# EAGLE design D1MBLUE (EAGLE 6.5.0)
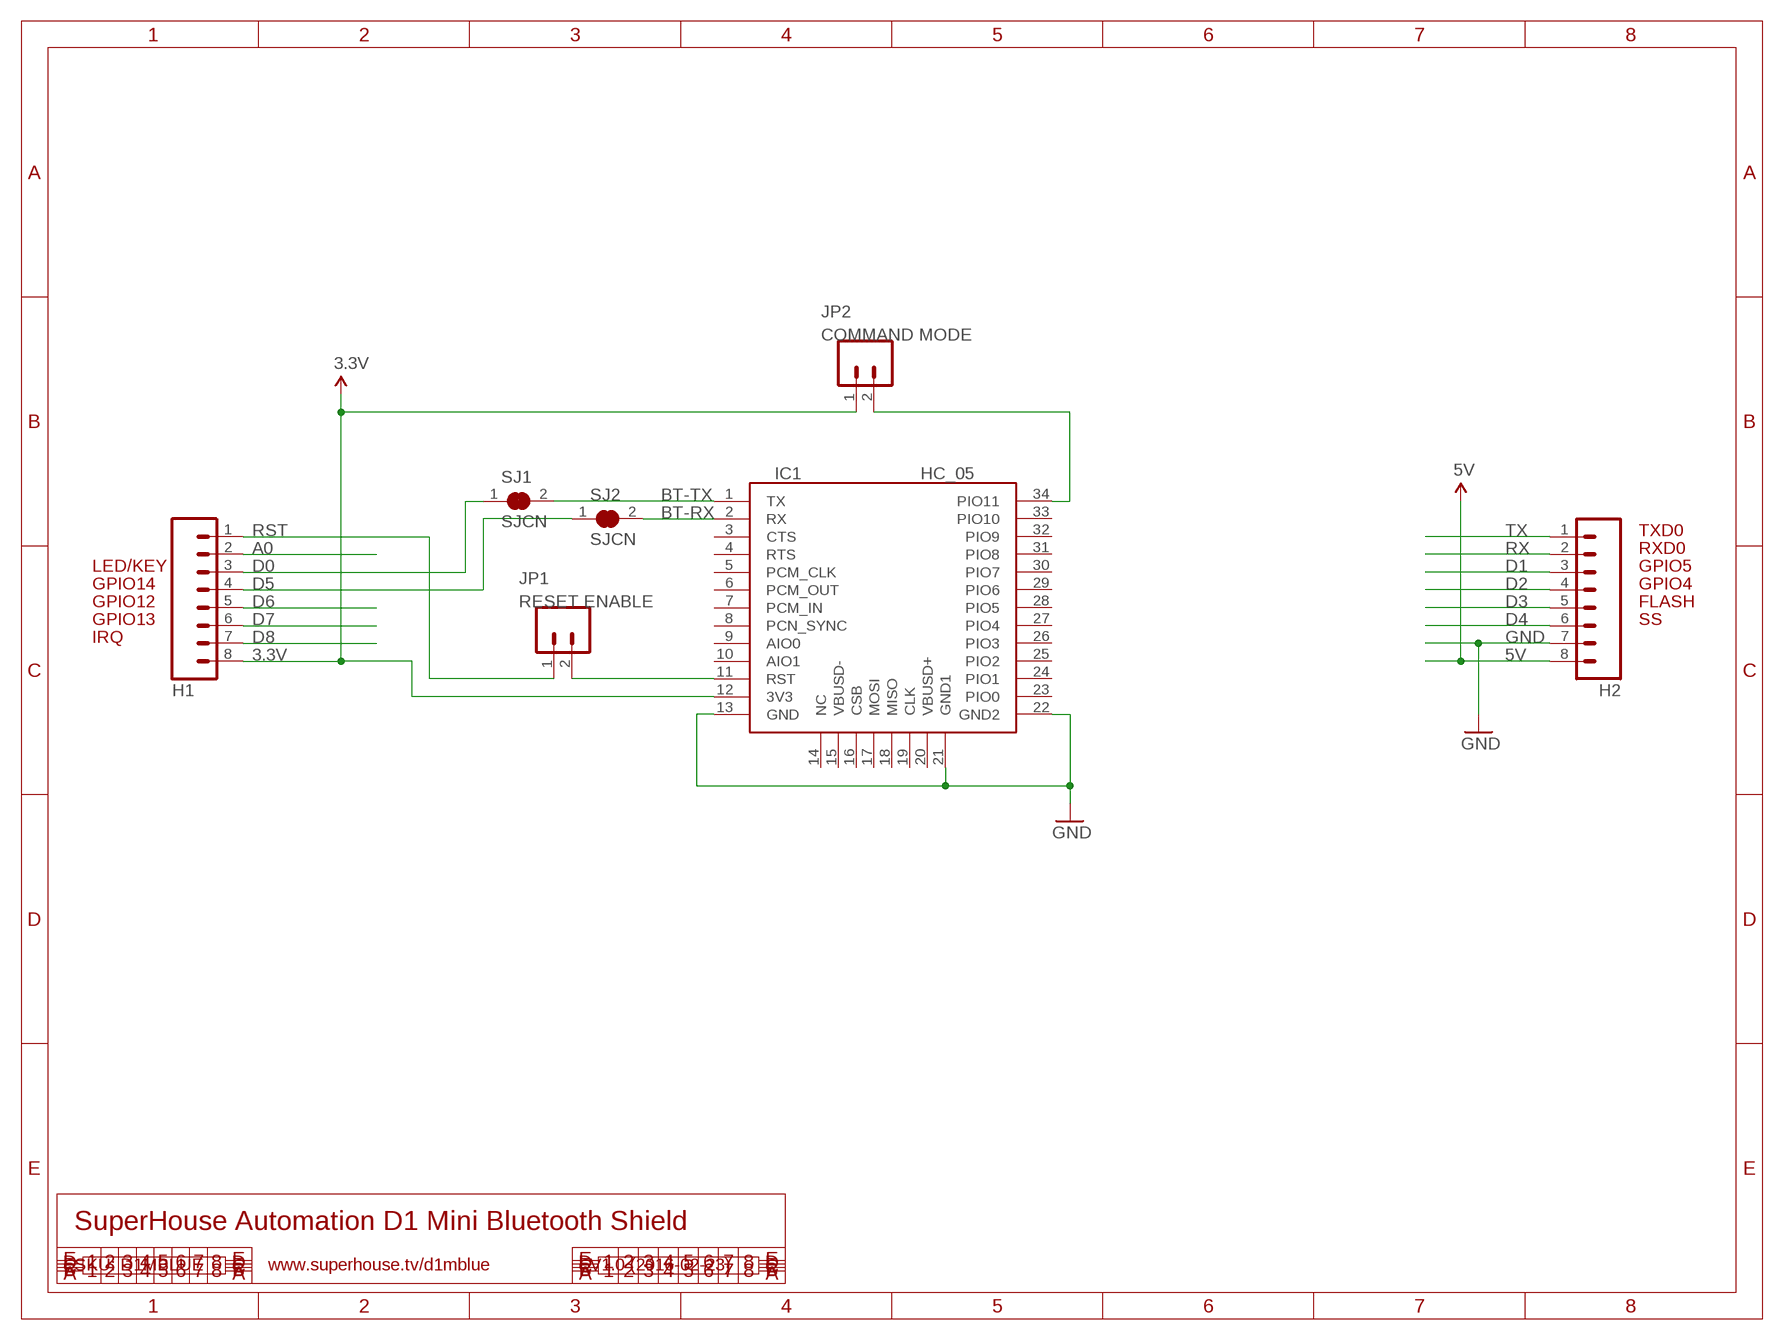
[diagram p0: schematic, sheet 1]

## Parts
H1  M08  [1X08]
H2  M08  [1X08]
IC1  HC_05  [BLUETOOTH_SMD]
JP1  RESET ENABLE  M02PTH  [1X02]
JP2  COMMAND MODE  M02PTH  [1X02]
SJ1  SJCN  [SJC]
SJ2  SJCN  [SJC]

## Nets
3.3V: H1.8 IC1.12(3V3) JP2.1
5V: H2.8
A0: H1.2
BT-RX: IC1.2(RX) SJ2.2
BT-TX: IC1.1(TX) SJ1.2
D0: H1.3 SJ1.1
D1: H2.3
D2: H2.4
D3: H2.5
D4: H2.6
D5: H1.4 SJ2.1
D6: H1.5
D7: H1.6
D8: H1.7
GND: H2.7 IC1.13(GND) IC1.21(GND1) IC1.22(GND2)
N$1: IC1.11(RST) JP1.2
N$3: IC1.34(PIO11) JP2.2
RST: H1.1 JP1.1
RX: H2.2
TX: H2.1
Unconnected: IC1.3(CTS) IC1.4(RTS) IC1.5(PCM_CLK) IC1.6(PCM_OUT) IC1.7(PCM_IN) IC1.8(PCN_SYNC) IC1.9(AIO0) IC1.10(AIO1) IC1.14(NC) IC1.15(VBUSD-) IC1.16(CSB) IC1.17(MOSI) IC1.18(MISO) IC1.19(CLK) IC1.20(VBUSD+) IC1.23(PIO0) IC1.24(PIO1) IC1.25(PIO2) IC1.26(PIO3) IC1.27(PIO4) IC1.28(PIO5) IC1.29(PIO6) IC1.30(PIO7) IC1.31(PIO8) IC1.32(PIO9) IC1.33(PIO10)

## Notes on the sheet
- TXD0
- RXD0
- LED/KEY | GPIO5
- GPIO14 | GPIO4
- GPIO12 | FLASH
- GPIO13 | SS
- IRQ
- SuperHouse Automation D1 Mini Bluetooth Shield
- SKU: D1MBLUE | www.superhouse.tv/d1mblue | V1.0 (2016-02-23)

## Library data of the parts
H1 H2 = freetronics-original:M08: Header 8 Standard 8-pin 0.1" header. Use with straight break away headers (SKU : PRT-00116), right angle break away headers (PRT-00553), swiss pins (PRT-00743), machine pins (PRT-00117), and female headers (PRT-00115).
IC1 = freetronics-jon:HC_05
JP1 JP2 = freetronics-jon:M02: Header 2 Standard 2-pin 0.1" header. Use with straight break away headers (SKU : PRT-00116), right angle break away headers (PRT-00553), swiss pins (PRT-00743), machine pins (PRT-00117), and female headers (PRT-00115). Molex polarized connector foot print use with SKU : PRT-08233 with associated crimp pins and housings.
SJ1 SJ2 = freetronics-jon:SJC

## Net classes
0 default: width 0.203 mm, drill 0.356 mm, clearance 0.152 mm
1 power: width 0.203 mm, clearance 0.152 mm

## Board
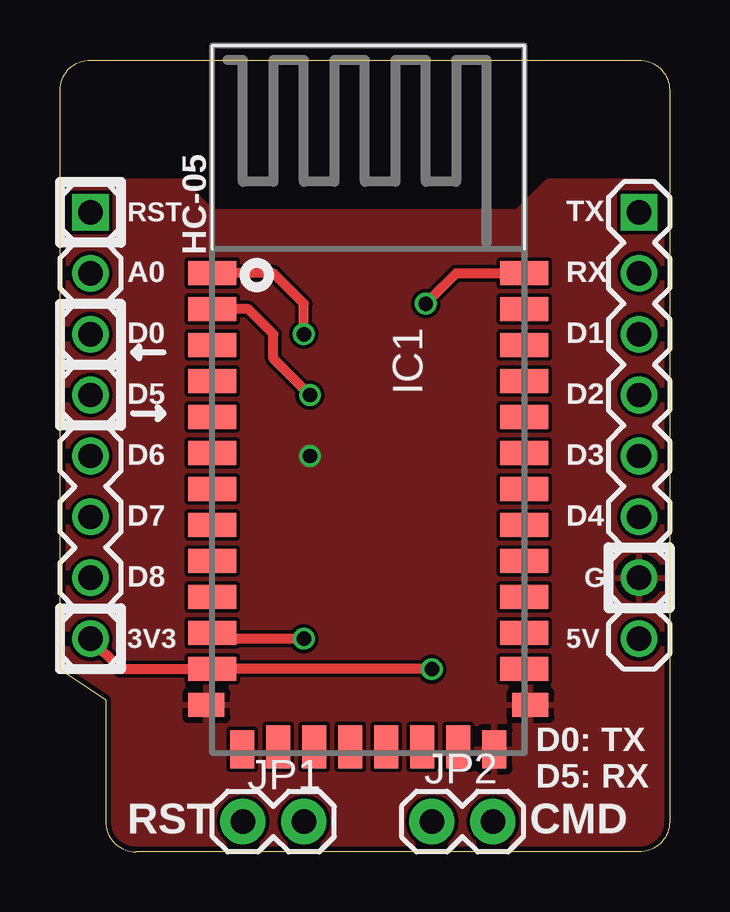
[diagram p1: board, top side]
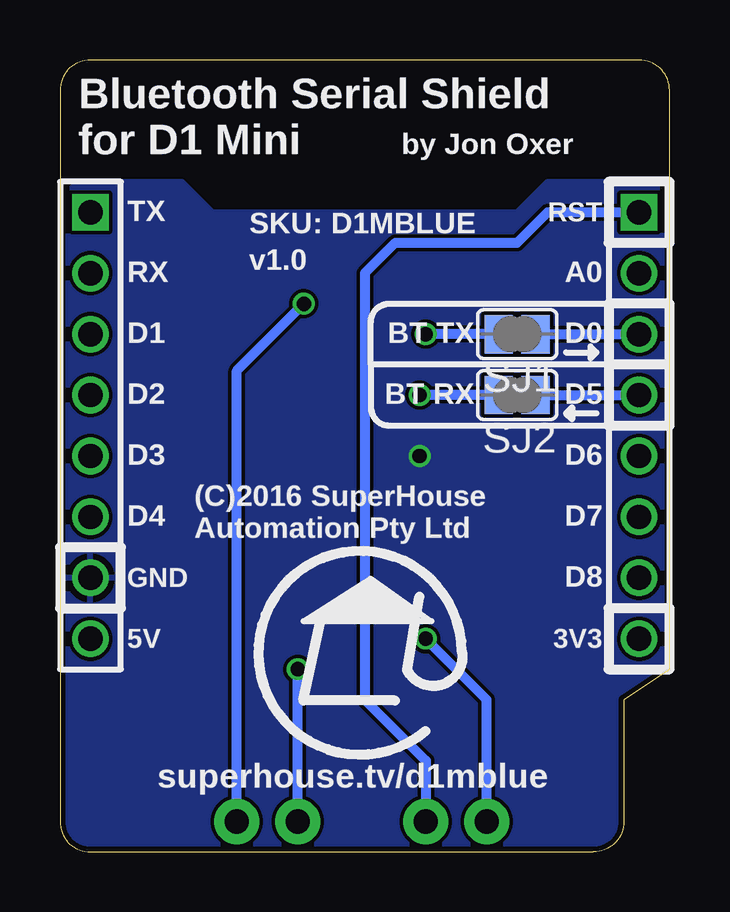
[diagram p2: board, bottom side, seen from below]

Size 25.4 x 33.02 mm. Coordinates in mm from the lower left corner, seen from the top.
Outline: 25.4,31.75 25.4,1.27 arc-90 24.13,0 3.17,0 arc-90 1.91,1.27 1.91,6.35 0,7.62 0,31.75 arc-90 1.27,33.02 24.13,33.02 arc-90 25.4,31.75
Copper layers (1*16): Top 0.035mm / dielectric 1.5mm / Bottom 0.035mm
Design rules "ElectroDragon_2layer_DRU_no_angle_20140221": minimum track width 6mil, minimum drill 12mil, track to track 6mil, track to pad 6mil, pad to pad 6mil, via to via 6mil, smd to smd 6mil, copper to edge 8mil, drill to drill 6mil, minimum pad ring 10mil, minimum via ring 6mil, stop-mask expansion 4mil, vias tented up to drill 100mil, thermal gap 10mil

### Footprints (pad centres in the part's own frame; a part is rotated, then mirrored left to right if it is on the bottom)
1X08 = drill 1.016 square: 1 0,0 | drill 1.016: 2 2.54,0; 3 5.08,0; 4 7.62,0; 5 10.16,0; 6 12.7,0; 7 15.24,0; 8 17.78,0
BLUETOOTH_SMD = smd 1 x 2: 1 -5.08,-6.35; 2 -3.58,-6.35; 3 -2.08,-6.35; 4 -0.58,-6.35; 5 0.92,-6.35; 6 2.42,-6.35; 7 3.92,-6.35; 8 5.42,-6.35; 9 6.92,-6.35; 10 8.42,-6.35; 11 9.92,-6.35; 12 11.42,-6.35; 23 11.42,6.65; 24 9.92,6.65; 25 8.42,6.65; 26 6.92,6.65; 27 5.42,6.65; 28 3.92,6.65; 29 2.42,6.65; 30 0.92,6.65; 31 -0.58,6.65; 32 -2.08,6.65; 33 -3.58,6.65; 34 -5.08,6.65 | smd 1 x 1.5: 13 12.92,-6.6; 22 12.92,6.9 | smd 1.6 x 1: 14 14.77,-5.1; 21 14.77,5.4 | smd 1.8 x 1: 15 14.67,-3.6; 16 14.67,-2.1; 17 14.67,-0.6; 18 14.67,0.9; 19 14.67,2.4; 20 14.67,3.9
1X02 = drill 1.016 pad 1.88: 1 0,0; 2 2.54,0
SJC = smd 1.168 x 1.6: 1 -0.762,0; 2 0.762,0

### Placement (x,y rotation side)
H1  1.27,26.67 270 top
H2  24.13,26.67 270 top
IC1  12.7,19.05 270 top
JP1  10.16,1.27 180 top
JP2  15.49,1.27 0 top
SJ1  6.35,21.59 180 bottom
SJ2  6.35,19.05 180 bottom

### Tracks (layer width: path | path; a pad name or v marks a point on that pad's centre or on a via)
3.3V  (via drill 0.6)
  Top 0.406: H1.8 2.53,7.63 IC1.12 15.23,7.63 v15.49,7.62
  Bottom 0.406: JP2.1 v15.49,7.62
BT-RX  (via drill 0.6)
  Top 0.406: v10.41,19.05 8.89,20.57 8.89,21.59 7.85,22.63 IC1.2
  Bottom 0.406: SJ2.2 v10.41,19.05
BT-TX  (via drill 0.6)
  Top 0.406: v10.16,21.59 10.16,22.86 8.89,24.13 IC1.1
  Bottom 0.406: SJ1.2 v10.16,21.59
D0
  Bottom 0.406: SJ1.1 H1.3
D5
  Bottom 0.406: SJ2.1 H1.4
GND  (via drill 0.6)
  other vias: 10.41,16.51
  pour Top: 25.4,26.67 arc90 24.13,27.94 20.32,27.94 19.05,26.67 6.35,26.67 5.08,27.94 1.27,27.94 arc90 0,26.67 0,7.62 1.91,6.35 1.91,1.27 arc90 3.17,0 24.13,0 arc90 25.4,1.27
  pour Bottom: 25.4,1.27 25.4,26.67 arc90 24.13,27.94 20.32,27.94 19.05,26.67 6.35,26.67 5.08,27.94 1.27,27.94 arc90 0,26.67 0,7.62 1.91,6.35 1.91,1.27 arc90 3.17,0 24.13,0 arc90
N$1  (via drill 0.6)
  Top 0.406: v10.16,8.89 6.59,8.89 IC1.11
  Bottom 0.406: JP1.2 7.62,6.35 v10.16,8.89
N$3  (via drill 0.6)
  Top 0.406: v15.24,22.86 16.51,24.13 IC1.34
  Bottom 0.406: JP2.2 18.03,20.07 v15.24,22.86
RST
  Bottom 0.406: H1.1 5.08,26.67 6.35,25.4 11.43,25.4 12.7,24.13 12.7,6.35 10.16,3.81 JP1.1

### Text on the board
tPlace: RST | TX | HC-05 | A0 | RX | D0 | D1 | D5 | D2 | D6 | D3 | D7 | D4 | D8 | G | 3V3 | 5V | D0: TX / D5: RX | RST | CMD
bPlace: by Jon Oxer | Bluetooth Serial Shield / for D1 Mini | RST | SKU: D1MBLUE | TX | A0 | v1.0 | RX | D0 | BT TX | D1 | D5 | BT RX | D2 | D6 | D3 | D7 | D4 | (C)2016 SuperHouse / Automation Pty Ltd | D8 | GND | 3V3 | 5V | superhouse.tv/d1mblue